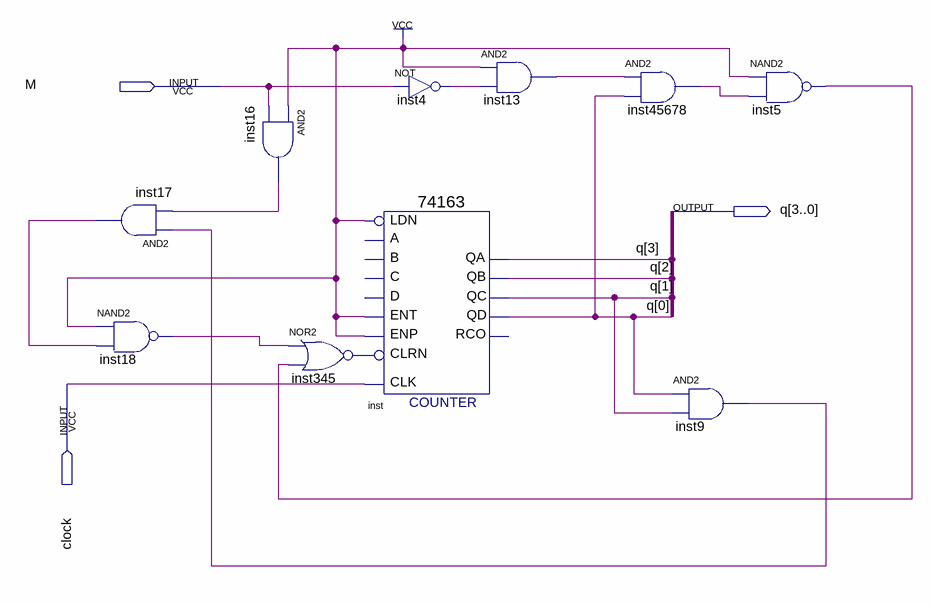
[diagram p0: schematic sheet]
// Quartus schematic MSpecialCount.bdf as structural Verilog: 10 symbols, 3 pins
module MSpecialCount (
  input  M,
  input  clock,
  output [3:0] q
);

  wire inst4_out, inst5_out, inst9_out, inst13_out, inst16_out, inst17_out, inst18_out, inst345_out,
       inst45678_out;

  and inst17 (inst17_out, inst9_out, inst16_out);
  nand inst18 (inst18_out, 1'b1, inst17_out);
  and inst16 (inst16_out, 1'b1, M);
  nor inst345 (inst345_out, inst18_out, inst5_out);
  not inst4 (inst4_out, M);
  \74163  inst (
    .ENT(1'b1), .CLRN(inst345_out), .CLK(clock), .ENP(1'b1), .LDN(1'b1), .QA(q[3]), .QB(q[2]), .QC(q[1]),
    .QD(q[0]));  // open: C, B, A, D, RCO
  and inst13 (inst13_out, 1'b1, inst4_out);
  and inst45678 (inst45678_out, inst13_out, q[0]);
  and inst9 (inst9_out, q[0], q[1]);
  nand inst5 (inst5_out, 1'b1, inst45678_out);
endmodule
